# Altium schematic sheet device1.SchDoc
size A3
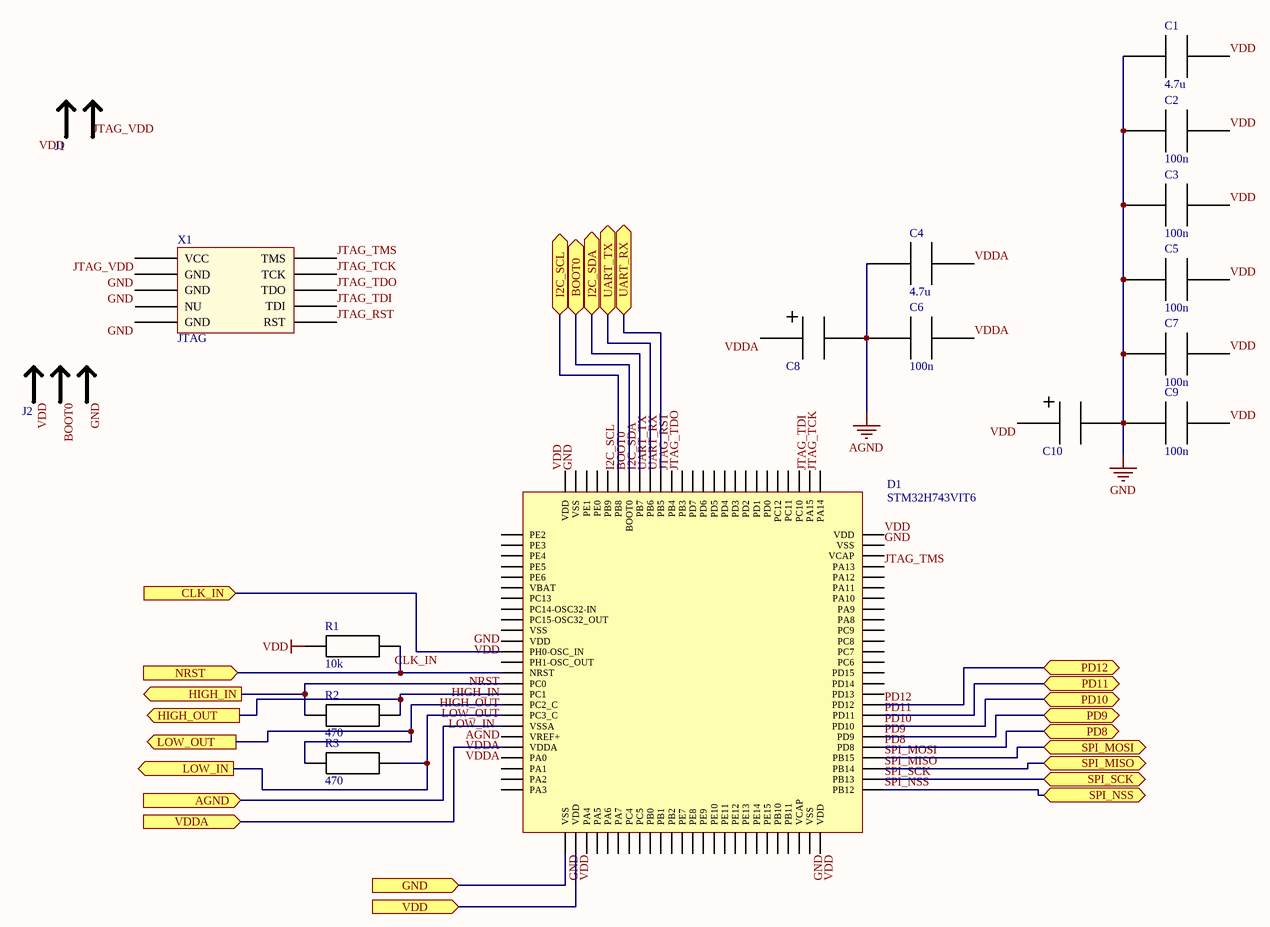
[diagram p0: device1.SchDoc]

## Parts
C1  4.7u  [0805]
C2  100n  [0805]
C3  100n  [0805]
C4  4.7u  [0805]
C5  100n  [0805]
C6  100n  [0805]
C7  100n  [0805]
C8  C_Ta  [C_Ta]  (value not drawn)
C9  100n  [0805]
C10  C_Ta  [C_Ta]  (value not drawn)
D1  STM32H743VIT6  [STM32H743VIT6]
J1  jumper switch  [JUMPER_SWITCH]  (value not drawn)
J2  JUMPER_SWITCH_2S  [JUMPER_SWITCH_2S]  (value not drawn)
R1  10k  [0805]
R2  470  [0805]
R3  470  [0805]
X1  JTAG  [JTAG_PLD]

## Ports
AGND (in), BOOT0 (bidir), CLK_IN (in), GND (in), HIGH_IN (out), HIGH_OUT (out), I2C_SCL (bidir), I2C_SDA (bidir), LOW_IN (out), LOW_OUT (out), NRST (in), PD8 (bidir), PD9 (bidir), PD10 (bidir), PD11 (bidir), PD12 (bidir), SPI_MISO (bidir), SPI_MOSI (bidir), SPI_NSS (bidir), SPI_SCK (bidir), UART_RX (bidir), UART_TX (bidir), VDD (in), VDDA (in)

## Nets
AGND: C4.1 C6.1 C8.2 D1.19(VSSA) ; port AGND
GND: C1.1 C2.1 C3.1 C5.1 C7.1 C9.1 C10.2 D1.10(VSS) D1.26(VSS) D1.49(VSS) D1.74(VSS) D1.99(VSS) J2.2 X1.3(GND) X1.5(GND) X1.9(GND) ; port GND
VDD: C1.2 C2.2 C3.2 C5.2 C7.2 C9.2 C10.1 D1.11(VDD) D1.27(VDD) D1.50(VDD) D1.75(VDD) D1.100(VDD) J1.0 J2.1 R1.1 ; port VDD
BOOT0: D1.94(BOOT0) J2.0 ; port BOOT0
CLK_IN: D1.12(PH0-OSC_IN) ; port CLK_IN
HIGH_IN: D1.15(PC0) R2.1 ; port HIGH_IN
HIGH_OUT: D1.16(PC1) R2.2 ; port HIGH_OUT
I2C_SCL: D1.95(PB8) ; port I2C_SCL
I2C_SDA: D1.93(PB7) ; port I2C_SDA
JTAG_RST: D1.90(PB4) X1.10(RST)
JTAG_TCK: D1.76(PA14) X1.4(TCK)
JTAG_TDI: D1.77(PA15) X1.8(TDI)
JTAG_TDO: D1.89(PB3) X1.6(TDO)
JTAG_TMS: D1.72(PA13) X1.2(TMS)
JTAG_VDD: J1.1 X1.1(VCC)
LOW_IN: D1.18(PC3_C) R3.1 ; port LOW_IN
LOW_OUT: D1.17(PC2_C) R3.2 ; port LOW_OUT
NRST: D1.14(NRST) R1.2 ; port NRST
PD8: D1.55(PD8) ; port PD8
PD9: D1.56(PD9) ; port PD9
PD10: D1.57(PD10) ; port PD10
PD11: D1.58(PD11) ; port PD11
PD12: D1.59(PD12) ; port PD12
SPI_MISO: D1.53(PB14) ; port SPI_MISO
SPI_MOSI: D1.54(PB15) ; port SPI_MOSI
SPI_NSS: D1.51(PB12) ; port SPI_NSS
SPI_SCK: D1.52(PB13) ; port SPI_SCK
UART_RX: D1.91(PB5) ; port UART_RX
UART_TX: D1.92(PB6) ; port UART_TX
VDDA: C4.2 C6.2 C8.1 D1.20(VREF+) D1.21(VDDA) ; port VDDA

Not connected (* = marked no-connect by the designer): D1 1(PE2) 2(PE3) 3(PE4) 4(PE5) 5(PE6) 6(VBAT) 7(PC13) 8(PC14-OSC32-IN) 9(PC15-OSC32_OUT) 13(PH1-OSC_OUT) 22(PA0) 23(PA1) 24(PA2) 25(PA3) 28(PA4) 29(PA5) 30(PA6) 31(PA7) 32(PC4) 33(PC5) 34(PB0) 35(PB1) 36(PB2) 37(PE7) 38(PE8) 39(PE9) 40(PE10) 41(PE11) 42(PE12) 43(PE13) 44(PE14) 45(PE15) 46(PB10) 47(PB11) 48(VCAP) 60(PD13) 61(PD14) 62(PD15) 63(PC6) 64(PC7) 65(PC8) 66(PC9) 67(PA8) 68(PA9) 69(PA10) 70(PA11) 71(PA12) 73(VCAP) 78(PC10) 79(PC11) 80(PC12) 81(PD0) 82(PD1) 83(PD2) 84(PD3) 85(PD4) 86(PD5) 87(PD6) 88(PD7) 96(PB9) 97(PE0) 98(PE1); X1 7(NU)

## Library data of the parts
C1-C7 C9 = C0805: 0805 ceramic capacitor
  C1 C4: Capacity: 4.7u
  C2 C3 C5-C7 C9: Capacity: 100n
C8 C10 = C_Ta: tantalum capacitor
D1 = STM32H743VIT6: 32-bit cortex m7 uc
J1 = JUMPER_SWITCH
J2 = JUMPER_SWITCH_2S: 2 state jumper switch
R1-R3 = R0805: 0805 resistor
  R1: Resistance: 10k
  R2 R3: Resistance: 470
X1 = JTAG: jtag pld